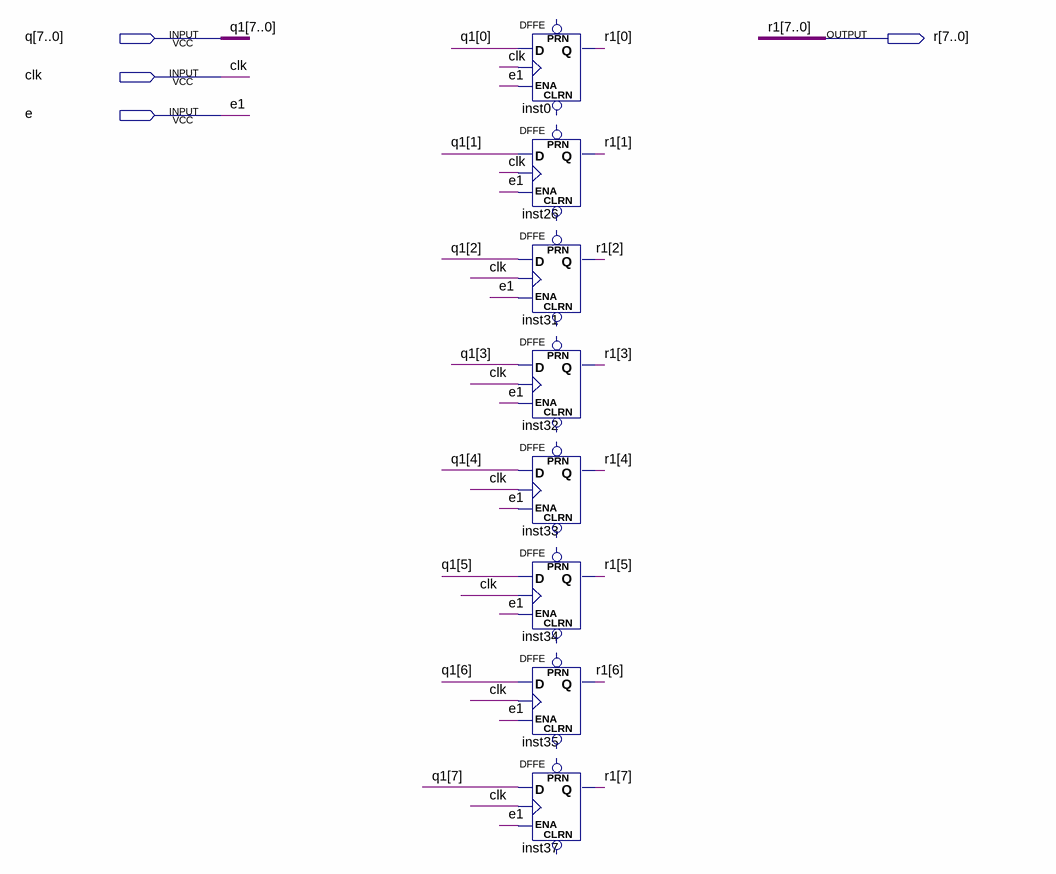
[diagram p0: schematic sheet]
// Quartus schematic register.bdf as structural Verilog: 8 symbols, 4 pins
module register (
  input  [7:0] q,
  input  clk,
  input  e,
  output [7:0] r
);

  DFFE inst0 (.D(q[0]), .CLK(clk), .ENA(e), .Q(r[0]));  // open: PRN, CLRN
  DFFE inst26 (.D(q[1]), .CLK(clk), .ENA(e), .Q(r[1]));  // open: PRN, CLRN
  DFFE inst31 (.D(q[2]), .CLK(clk), .ENA(e), .Q(r[2]));  // open: PRN, CLRN
  DFFE inst32 (.D(q[3]), .CLK(clk), .ENA(e), .Q(r[3]));  // open: PRN, CLRN
  DFFE inst33 (.D(q[4]), .CLK(clk), .ENA(e), .Q(r[4]));  // open: PRN, CLRN
  DFFE inst34 (.D(q[5]), .CLK(clk), .ENA(e), .Q(r[5]));  // open: PRN, CLRN
  DFFE inst35 (.D(q[6]), .CLK(clk), .ENA(e), .Q(r[6]));  // open: PRN, CLRN
  DFFE inst37 (.D(q[7]), .CLK(clk), .ENA(e), .Q(r[7]));  // open: PRN, CLRN

  // Other names for the same wires on the sheet: e1 = e; q1[7:0] = q; r1[7:0] = r
endmodule
